# Altium schematic sheet temp_meas.SchDoc
size A4; SheetNumber: 3; SheetTotal: 4
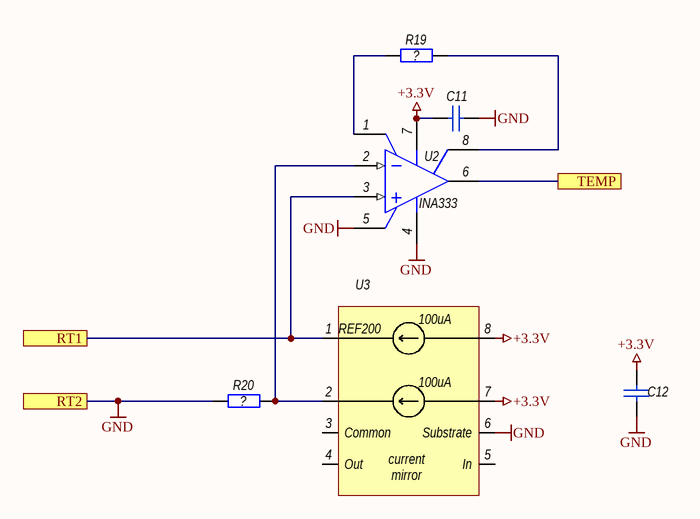
[diagram p0: temp_meas.SchDoc]

## Parts
C11  0603 1u 6.3V  [CAP_0805]  (value not drawn)
C12  0603 1u 6.3V  [CAP_0603]  (value not drawn)
R19  ?  [RES_0603]
R20  ?  [RES_0603]
U2  INA333  [MSOP-8]
U3  REF200  [SO8-150]

## Ports
RT1, RT2, TEMP

## Nets
+3.3V: C11.2 C12.2 U2.7(V+) U3.7 U3.8
GND: C11.1 C12.1 R20.1 U2.4(V-) U2.5(REF) U3.6(Substrate) ; port RT2
RT1: U2.3(IN+) U3.1 ; port RT1
TEMP: U2.6(OUT) ; port TEMP
NetR19_1: R19.1 U2.1(RG)
NetR19_2: R19.2 U2.8(RG)
NetR20_2: R20.2 U2.2(IN-) U3.2

Not connected (* = marked no-connect by the designer): U3 3(Common) 4(Out) 5(In)

## Notes on the sheet
- (in symbol REF200) 100uA; current; mirror

## Library data of the parts
C11 C12 = Capacitor: Конденсатор
R19 R20 = Resisitor: Резистор
U2 = INA333: Инструментальный усилитель; ValueBOM: INA333; ValueSCH: INA333; MarkPCB: INA333; HelpURL: C:\Datasheets\INA333.pdf
U3 = REF200: Источник опорного тока; ValueBOM: REF200; ValueSCH: REF200; MarkPCB: REF200; HelpURL: C:\Datasheets\REF200.pdf